# Altium project CPU-010.PrjPcb
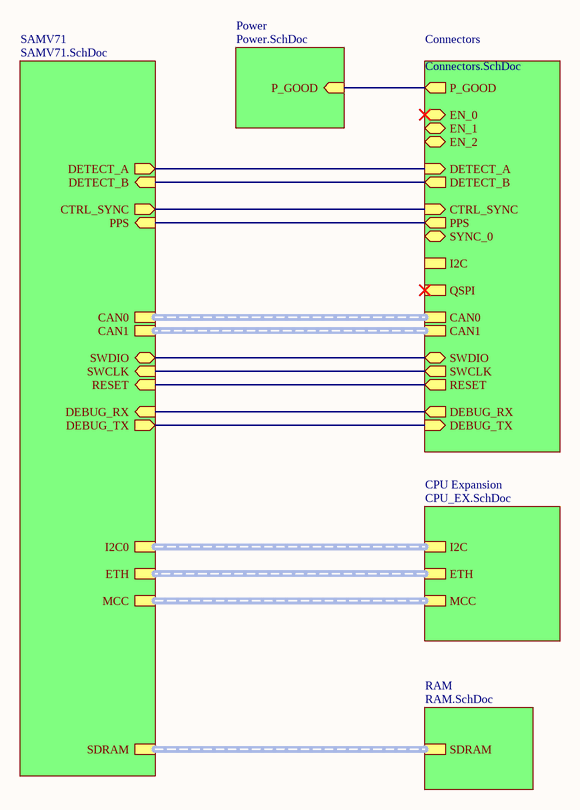
[diagram p0: Top.SchDoc]
TemplateRevision: B; ProjectTitle: SAM V71 CPU Module; ProjectRevision: A; ProjectOrganization: Let's Build Rockets Inc.; ProjectDocumentNumber: CPU-010; ProjectAuthor: E. Sims
6 sheets, 67 parts. Net scope: hierarchical (ports join the sheet entries above them; power ports are global).
Board file: CPU-010.PcbDoc
Sheets:
  Top.SchDoc
    RAM = RAM.SchDoc
    SAMV71 = SAMV71.SchDoc
    CPU Expansion = CPU_EX.SchDoc
    Connectors = Connectors.SchDoc
    Power = Power.SchDoc

## Sheet Top.SchDoc
size B; Author: E. Sims; Organization: Let's Build Rockets Inc.

### Sub-sheets
Connectors = Connectors.SchDoc: CAN0 (harness CAN), CAN1 (harness CAN), SYNC_0 (bidir), EN_2 (bidir), DETECT_A (in), SWDIO (bidir), CTRL_SYNC (in), P_GOOD (out), EN_1 (bidir), EN_0 (bidir), DETECT_B (out), DEBUG_RX (out), PPS (out), QSPI (harness QSPI), RESET (out), DEBUG_TX (in), SWCLK (out), I2C (harness I2C)
CPU Expansion = CPU_EX.SchDoc: ETH (harness ETH), MCC (harness MCC), I2C (harness I2C)
Power = Power.SchDoc: P_GOOD (in)
RAM = RAM.SchDoc: SDRAM (harness SDRAM)
SAMV71 = SAMV71.SchDoc: SDRAM (harness SDRAM), CAN0 (harness CAN), I2C0 (harness I2C), MCC (harness MCC), CAN1 (harness CAN), ETH (harness ETH), DETECT_A (out), PPS (in), DETECT_B (in), CTRL_SYNC (out), DEBUG_RX (in), SWDIO (bidir), SWCLK (in), DEBUG_TX (out), RESET (in)

### Nets
CTRL_SYNC: sheet SAMV71/CTRL_SYNC, sheet Connectors/CTRL_SYNC
DETECT_A: sheet SAMV71/DETECT_A, sheet Connectors/DETECT_A
P_GOOD: sheet Connectors/P_GOOD, sheet Power/P_GOOD
PPS: sheet SAMV71/PPS, sheet Connectors/PPS
NetP1_32: sheet SAMV71/DETECT_B, sheet Connectors/DETECT_B
NetP3_2: sheet SAMV71/SWDIO, sheet Connectors/SWDIO
NetP3_4: sheet SAMV71/SWCLK, sheet Connectors/SWCLK
NetP3_10: sheet SAMV71/RESET, sheet Connectors/RESET
NetP4_3: sheet SAMV71/DEBUG_TX, sheet Connectors/DEBUG_TX
NetP4_4: sheet SAMV71/DEBUG_RX, sheet Connectors/DEBUG_RX

### Buses and harness runs
harness sheet Connectors/CAN0 = sheet SAMV71/CAN0
harness sheet Connectors/CAN1 = sheet SAMV71/CAN1
harness sheet CPU Expansion/ETH = sheet SAMV71/ETH
harness sheet CPU Expansion/I2C = sheet SAMV71/I2C0
harness sheet CPU Expansion/MCC = sheet SAMV71/MCC
harness sheet RAM/SDRAM = sheet SAMV71/SDRAM

### Notes on the sheet
- Let's Build Rocket's Inc. Modular Paylaod System Based on TMP-010 Rev
  For more information visit https://github.com/LetsBuildRockets/Modular-Payload-System
  This work is licensed under CC BY-NC 4.0. To view a copy of this license, visit https://creativecommons.org/licenses/by-nc/4.0
- Title
- Size:
- Date:
- Assembly Variant:
- B
- Number:
- Time:
- Revision:
- Sheet
- of
- Author:
- File:

## Sheet RAM.SchDoc
size B; SheetNumber: 4; SheetTotal: 5
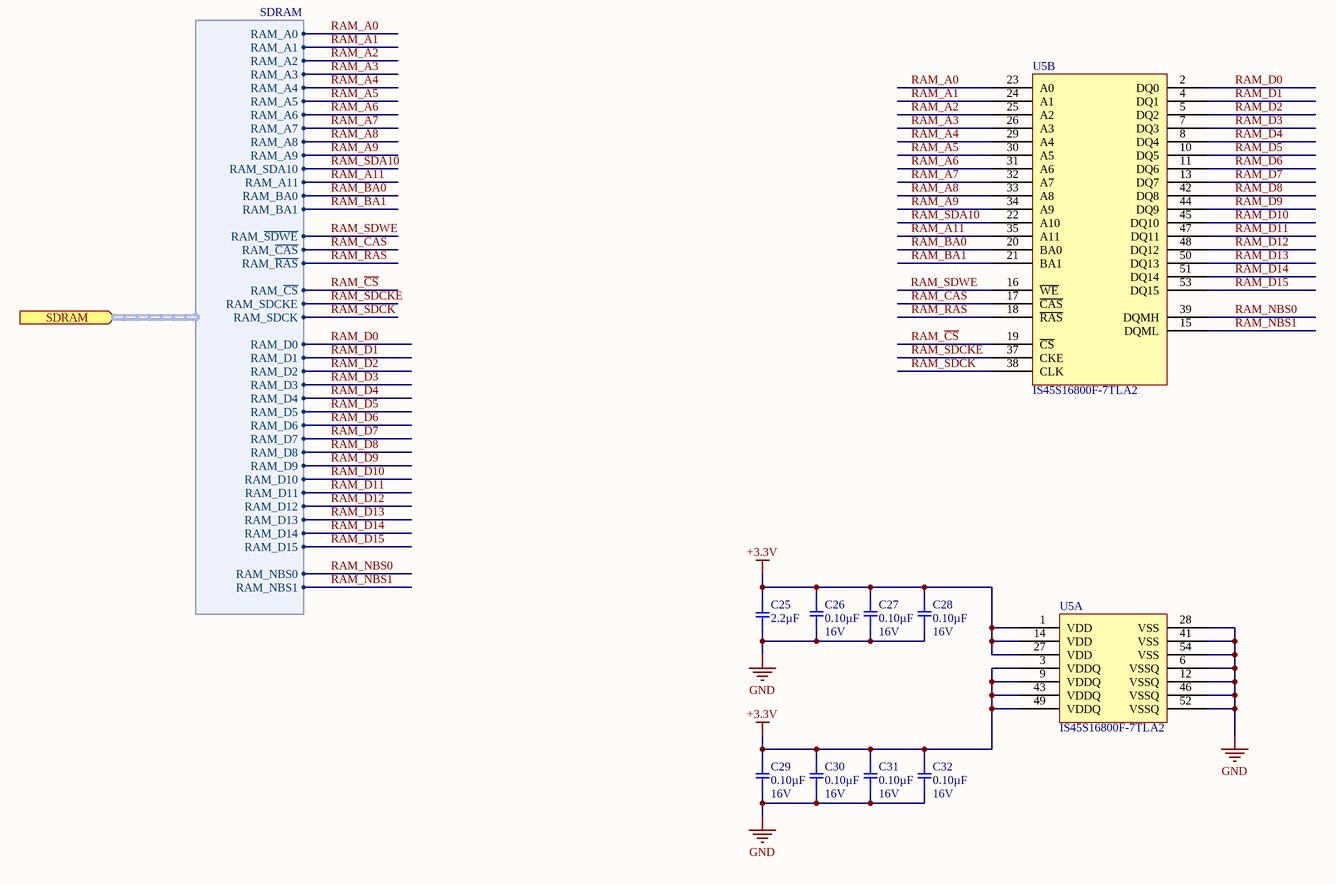
[diagram p1: RAM.SchDoc]

### Parts
C25  2.2µF  [SMD-0603C]
C26  0.10µF  Voltage: 16V  [SMD-0402C]
C27  0.10µF  Voltage: 16V  [SMD-0402C]
C28  0.10µF  Voltage: 16V  [SMD-0402C]
C29  0.10µF  Voltage: 16V  [SMD-0402C]
C30  0.10µF  Voltage: 16V  [SMD-0402C]
C31  0.10µF  Voltage: 16V  [SMD-0402C]
C32  0.10µF  Voltage: 16V  [SMD-0402C]
U5  IS45S16800F-7TLA2  [TSOP80P1180X120-54N]  (parts A,B of 2)

### Ports
SDRAM (in, harness SDRAM)

### Harnesses
SDRAM: RAM_A0, RAM_A1, RAM_A2, RAM_A3, RAM_A4, RAM_A5, RAM_A6, RAM_A7, RAM_A8, RAM_A9, RAM_SDA10, RAM_A11, RAM_BA0, RAM_BA1, RAM_~{SDWE}, RAM_~{CAS}, RAM_~{RAS}, RAM_SDCKE, RAM_SDCK, RAM_~{CS}, RAM_D0, RAM_D1, RAM_D2, RAM_D3, RAM_D4, RAM_D5, RAM_D6, RAM_D7, RAM_D8, RAM_D9, RAM_D10, RAM_D11, RAM_D12, RAM_D13, RAM_D14, RAM_D15, RAM_NBS0, RAM_NBS1

### Nets
+3.3V: C25.1 C26.2 C27.2 C28.2 C29.2 C30.2 C31.2 C32.2 U5.1(VDD) U5.3(VDDQ) U5.9(VDDQ) U5.14(VDD) U5.27(VDD) U5.43(VDDQ) U5.49(VDDQ)
GND: C25.2 C26.1 C27.1 C28.1 C29.1 C30.1 C31.1 C32.1 U5.6(VSSQ) U5.12(VSSQ) U5.28(VSS) U5.41(VSS) U5.46(VSSQ) U5.52(VSSQ) U5.54(VSS)
RAM_A0: U5.23(A0) ; port SDRAM.RAM_A0
RAM_A1: U5.24(A1) ; port SDRAM.RAM_A1
RAM_A2: U5.25(A2) ; port SDRAM.RAM_A2
RAM_A3: U5.26(A3) ; port SDRAM.RAM_A3
RAM_A4: U5.29(A4) ; port SDRAM.RAM_A4
RAM_A5: U5.30(A5) ; port SDRAM.RAM_A5
RAM_A6: U5.31(A6) ; port SDRAM.RAM_A6
RAM_A7: U5.32(A7) ; port SDRAM.RAM_A7
RAM_A8: U5.33(A8) ; port SDRAM.RAM_A8
RAM_A9: U5.34(A9) ; port SDRAM.RAM_A9
RAM_A11: U5.35(A11) ; port SDRAM.RAM_A11
RAM_BA0: U5.20(BA0) ; port SDRAM.RAM_BA0
RAM_BA1: U5.21(BA1) ; port SDRAM.RAM_BA1
RAM_~{CS}: U5.19(~{CS}) ; port SDRAM.RAM_~{CS}
RAM_CAS: U5.17(~{CAS}) ; port SDRAM.RAM_~{CAS}
RAM_D0: U5.2(DQ0) ; port SDRAM.RAM_D0
RAM_D1: U5.4(DQ1) ; port SDRAM.RAM_D1
RAM_D2: U5.5(DQ2) ; port SDRAM.RAM_D2
RAM_D3: U5.7(DQ3) ; port SDRAM.RAM_D3
RAM_D4: U5.8(DQ4) ; port SDRAM.RAM_D4
RAM_D5: U5.10(DQ5) ; port SDRAM.RAM_D5
RAM_D6: U5.11(DQ6) ; port SDRAM.RAM_D6
RAM_D7: U5.13(DQ7) ; port SDRAM.RAM_D7
RAM_D8: U5.42(DQ8) ; port SDRAM.RAM_D8
RAM_D9: U5.44(DQ9) ; port SDRAM.RAM_D9
RAM_D10: U5.45(DQ10) ; port SDRAM.RAM_D10
RAM_D11: U5.47(DQ11) ; port SDRAM.RAM_D11
RAM_D12: U5.48(DQ12) ; port SDRAM.RAM_D12
RAM_D13: U5.50(DQ13) ; port SDRAM.RAM_D13
RAM_D14: U5.51(DQ14) ; port SDRAM.RAM_D14
RAM_D15: U5.53(DQ15) ; port SDRAM.RAM_D15
RAM_NBS0: U5.39(DQMH) ; port SDRAM.RAM_NBS0
RAM_NBS1: U5.15(DQML) ; port SDRAM.RAM_NBS1
RAM_RAS: U5.18(~{RAS}) ; port SDRAM.RAM_~{RAS}
RAM_SDA10: U5.22(A10) ; port SDRAM.RAM_SDA10
RAM_SDCK: U5.38(CLK) ; port SDRAM.RAM_SDCK
RAM_SDCKE: U5.37(CKE) ; port SDRAM.RAM_SDCKE
RAM_SDWE: U5.16(~{WE}) ; port SDRAM.RAM_~{SDWE}

### Notes on the sheet
- Let's Build Rocket's Inc. Modular Paylaod System Based on TMP-010 Rev
  For more information visit https://github.com/LetsBuildRockets/Modular-Payload-System
  This work is licensed under CC BY-NC 4.0. To view a copy of this license, visit https://creativecommons.org/licenses/by-nc/4.0
- Title
- Size:
- Date:
- Assembly Variant:
- B
- Number:
- Time:
- Revision:
- Sheet
- of
- Author:
- File:

### Library data of the parts
C25 = GCM188R70J225KE22D: CAP CER 2.2UF 6.3V X7R 0603; Manufacturer: Murata Electronics North America; Factory Stock: 0; Unit Price (USD): 0.23; Minimum Quantity: 1; Tolerance: ±10%; Datasheets: http://www.murata.com/~/media/webrenewal/support/library/catalog/products/capacitor/mlcc/c03e.ashx; Image: //media.digikey.com/Renders/Murata%20Renders/0603%28GCM188%29.jpg; Digi-Key Part Number: 490-5316-1-ND; Part Number: GCM188R70J225KE22D; Quantity Available: 20695; @ qty: 0; Packaging: Cut Tape (CT); Series: GCM; Part Status: Active; Value: 2.2µF; Voltage: 6.3V; Temperature Coefficient: X7R; Operating Temperature: -55°C ~ 125°C; Features: -; Ratings: AEC-Q200; Applications: Automotive; Mounting Type: Surface Mount, MLCC; Package / Case: 0603 (1608 Metric); Size / Dimension: 0.063" L x 0.031" W (1.60mm x 0.80mm); Height - Seated (Max): -; Thickness (Max): 0.035" (0.90mm); Lead Spacing: -; Lead Style: -
C26-C32 = GCM155R71C104KA55D: CAP CER 0.1UF 16V X7R 0402; Manufacturer: Murata Electronics North America; Factory Stock: 0; Unit Price (USD): 0.1; Minimum Quantity: 1; Tolerance: ±10%; Datasheets: http://www.murata.com/~/media/webrenewal/support/library/catalog/products/capacitor/mlcc/c03e.ashx; Image: //media.digikey.com/Renders/Murata%20Renders/ZRB-SERIES-0402.jpg; Digi-Key Part Number: 490-4759-1-ND; Part Number: GCM155R71C104KA55D; Quantity Available: 734194; @ qty: 0; Packaging: Cut Tape (CT); Series: GCM; Part Status: Active; Value: 0.10µF; Temperature Coefficient: X7R; Operating Temperature: -55°C ~ 125°C; Features: -; Ratings: AEC-Q200; Applications: Automotive; Mounting Type: Surface Mount, MLCC; Package / Case: 0402 (1005 Metric); Size / Dimension: 0.039" L x 0.020" W (1.00mm x 0.50mm); Height - Seated (Max): -; Thickness (Max): 0.022" (0.55mm); Lead Spacing: -; Lead Style: -
U5 = IS45S16800F-7TLA2: Unit Price (USD): 5.18

## Sheet SAMV71.SchDoc: =ProjectTitle
size B; Author: E. Sims; Organization: Let's Build Rockets Inc.; Revision: A; SheetNumber: 3; SheetTotal: 5
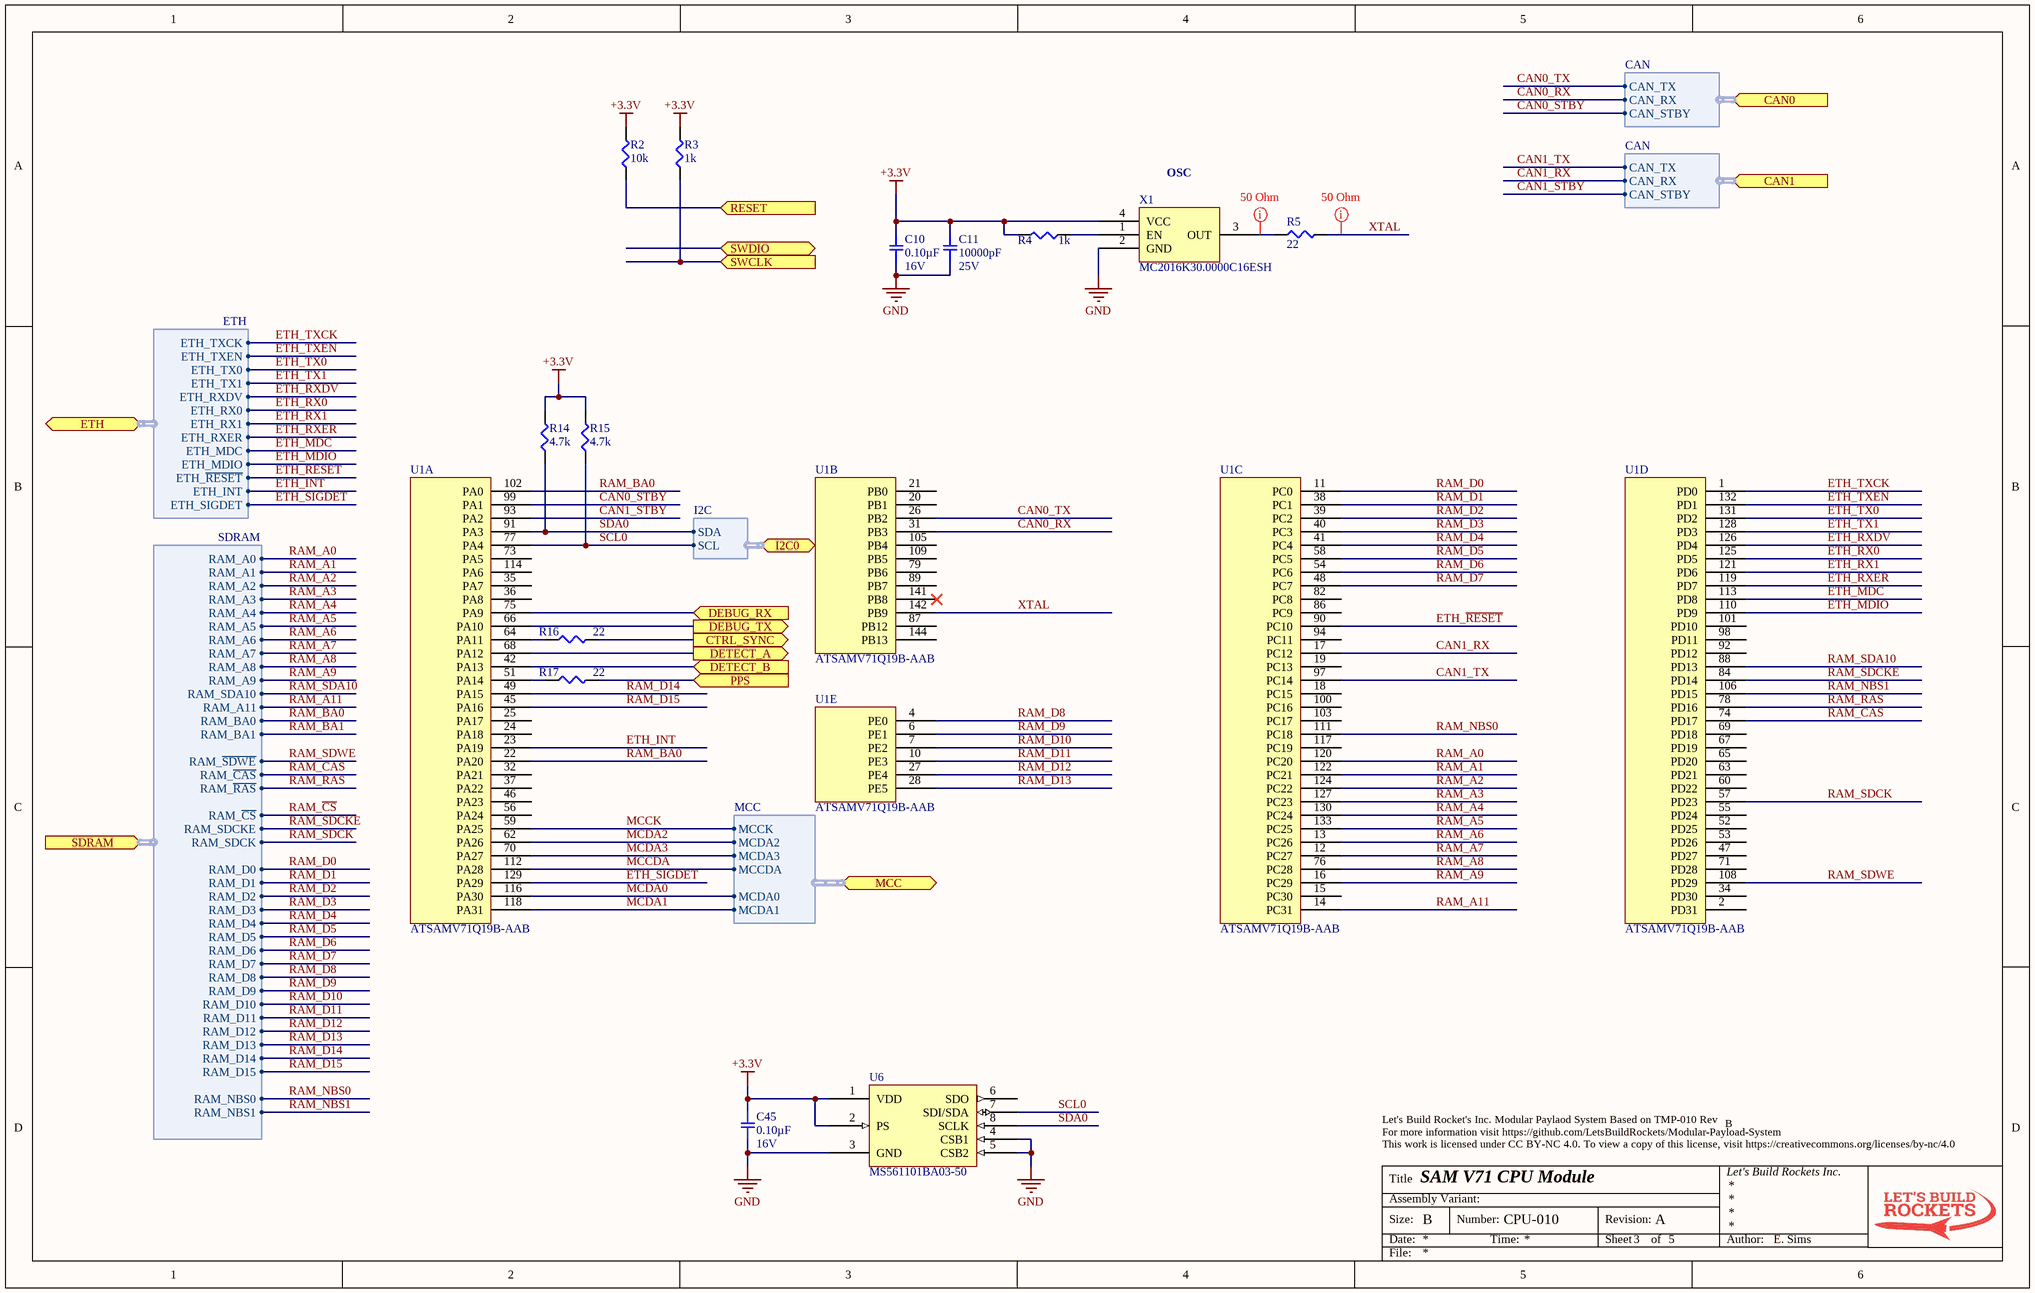
[diagram p2: SAMV71.SchDoc]

### Parts
C10  0.10µF  Voltage: 16V  [SMD-0402C]
C11  10000pF  Voltage: 25V  [SMD-0402C]
C45  0.10µF  Voltage: 16V  [SMD-0402C]
R2  10k  [SMD-0402-RES]
R3  1k  [SMD-0402-RES]
R4  1k  [SMD-0402-RES]
R5  22  [SMD-0402-RES]
R14  4.7k  [SMD-0402-RES]
R15  4.7k  [SMD-0402-RES]
R16  22  [SMD-0402-RES]
R17  22  [SMD-0402-RES]
U1  ATSAMV71Q19B-AAB  [TSQFP50P2200X2200X160-144N]  (parts A,B,C,D,E of 6)
U6  MS561101BA03-50  [MS561101BA03-50]
X1  MC2016K30.0000C16ESH  [MC2016]

### Ports
CAN0 (in, harness CAN), CAN1 (in, harness CAN), CTRL_SYNC (out), DEBUG_RX (in), DEBUG_TX (out), DETECT_A (out), DETECT_B (in), ETH (bidir, harness ETH), I2C0 (bidir, harness I2C), MCC (bidir, harness MCC), PPS (in), RESET (in), SDRAM (in, harness SDRAM), SWCLK (in), SWDIO (bidir)

### Harnesses
SDRAM: RAM_A0, RAM_A1, RAM_A2, RAM_A3, RAM_A4, RAM_A5, RAM_A6, RAM_A7, RAM_A8, RAM_A9, RAM_SDA10, RAM_A11, RAM_BA0, RAM_BA1, RAM_~{SDWE}, RAM_~{CAS}, RAM_~{RAS}, RAM_SDCKE, RAM_SDCK, RAM_~{CS}, RAM_D0, RAM_D1, RAM_D2, RAM_D3, RAM_D4, RAM_D5, RAM_D6, RAM_D7, RAM_D8, RAM_D9, RAM_D10, RAM_D11, RAM_D12, RAM_D13, RAM_D14, RAM_D15, RAM_NBS0, RAM_NBS1
CAN: CAN_TX, CAN_RX, CAN_STBY
MCC: MCCK, MCCDA, MCDA0, MCDA1, MCDA2, MCDA3
ETH: ETH_TXCK, ETH_TXEN, ETH_TX0, ETH_TX1, ETH_RXDV, ETH_RX0, ETH_RX1, ETH_RXER, ETH_MDC, ETH_MDIO, ETH_~{RESET}, ETH_INT, ETH_SIGDET
I2C: SDA, SCL

### Nets
+3.3V: C10.2 C11.2 C45.2 R2.2 R3.2 R4.2 R14.2 R15.2 U6.1(VDD) U6.2(PS) X1.4(VCC)
GND: C10.1 C11.1 C45.1 U6.3(GND) U6.4(CSB1) U6.5(CSB2) X1.2(GND)
CAN0_RX: U1.31(PB3) ; port CAN0.CAN_RX
CAN0_STBY: U1.99(PA1) ; port CAN0.CAN_STBY
CAN0_TX: U1.26(PB2) ; port CAN0.CAN_TX
CAN1_RX: U1.17(PC12) ; port CAN1.CAN_RX
CAN1_STBY: U1.93(PA2) ; port CAN1.CAN_STBY
CAN1_TX: U1.97(PC14) ; port CAN1.CAN_TX
CTRL_SYNC: R16.2 ; port CTRL_SYNC
DETECT_A: U1.68(PA12) ; port DETECT_A
ETH_INT: U1.23(PA19) ; port ETH.ETH_INT
ETH_MDC: U1.113(PD8) ; port ETH.ETH_MDC
ETH_MDIO: U1.110(PD9) ; port ETH.ETH_MDIO
ETH_~{RESET}: U1.90(PC10) ; port ETH.ETH_~{RESET}
ETH_RX0: U1.125(PD5) ; port ETH.ETH_RX0
ETH_RX1: U1.121(PD6) ; port ETH.ETH_RX1
ETH_RXDV: U1.126(PD4) ; port ETH.ETH_RXDV
ETH_RXER: U1.119(PD7) ; port ETH.ETH_RXER
ETH_SIGDET: U1.129(PA29) ; port ETH.ETH_SIGDET
ETH_TX0: U1.131(PD2) ; port ETH.ETH_TX0
ETH_TX1: U1.128(PD3) ; port ETH.ETH_TX1
ETH_TXCK: U1.1(PD0) ; port ETH.ETH_TXCK
ETH_TXEN: U1.132(PD1) ; port ETH.ETH_TXEN
MCCDA: U1.112(PA28) ; port MCC.MCCDA
MCCK: U1.59(PA25) ; port MCC.MCCK
MCDA0: U1.116(PA30) ; port MCC.MCDA0
MCDA1: U1.118(PA31) ; port MCC.MCDA1
MCDA2: U1.62(PA26) ; port MCC.MCDA2
MCDA3: U1.70(PA27) ; port MCC.MCDA3
PPS: R17.2 ; port PPS
RAM_A0: U1.120(PC20) ; port SDRAM.RAM_A0
RAM_A1: U1.122(PC21) ; port SDRAM.RAM_A1
RAM_A2: U1.124(PC22) ; port SDRAM.RAM_A2
RAM_A3: U1.127(PC23) ; port SDRAM.RAM_A3
RAM_A4: U1.130(PC24) ; port SDRAM.RAM_A4
RAM_A5: U1.133(PC25) ; port SDRAM.RAM_A5
RAM_A6: U1.13(PC26) ; port SDRAM.RAM_A6
RAM_A7: U1.12(PC27) ; port SDRAM.RAM_A7
RAM_A8: U1.76(PC28) ; port SDRAM.RAM_A8
RAM_A9: U1.16(PC29) ; port SDRAM.RAM_A9
RAM_A11: U1.14(PC31) ; port SDRAM.RAM_A11
RAM_BA0: U1.22(PA20) U1.102(PA0) ; port SDRAM.RAM_BA0
RAM_CAS: U1.74(PD17) ; port SDRAM.RAM_~{CAS}
RAM_D0: U1.11(PC0) ; port SDRAM.RAM_D0
RAM_D1: U1.38(PC1) ; port SDRAM.RAM_D1
RAM_D2: U1.39(PC2) ; port SDRAM.RAM_D2
RAM_D3: U1.40(PC3) ; port SDRAM.RAM_D3
RAM_D4: U1.41(PC4) ; port SDRAM.RAM_D4
RAM_D5: U1.58(PC5) ; port SDRAM.RAM_D5
RAM_D6: U1.54(PC6) ; port SDRAM.RAM_D6
RAM_D7: U1.48(PC7) ; port SDRAM.RAM_D7
RAM_D8: U1.4(PE0) ; port SDRAM.RAM_D8
RAM_D9: U1.6(PE1) ; port SDRAM.RAM_D9
RAM_D10: U1.7(PE2) ; port SDRAM.RAM_D10
RAM_D11: U1.10(PE3) ; port SDRAM.RAM_D11
RAM_D12: U1.27(PE4) ; port SDRAM.RAM_D12
RAM_D13: U1.28(PE5) ; port SDRAM.RAM_D13
RAM_D14: U1.49(PA15) ; port SDRAM.RAM_D14
RAM_D15: U1.45(PA16) ; port SDRAM.RAM_D15
RAM_NBS0: U1.111(PC18) ; port SDRAM.RAM_NBS0
RAM_NBS1: U1.106(PD15) ; port SDRAM.RAM_NBS1
RAM_RAS: U1.78(PD16) ; port SDRAM.RAM_~{RAS}
RAM_SDA10: U1.88(PD13) ; port SDRAM.RAM_SDA10
RAM_SDCK: U1.57(PD23) ; port SDRAM.RAM_SDCK
RAM_SDCKE: U1.84(PD14) ; port SDRAM.RAM_SDCKE
RAM_SDWE: U1.108(PD29) ; port SDRAM.RAM_~{SDWE}
SCL0: R15.1 U1.77(PA4) U6.7(SDI/SDA) ; port I2C0.SCL
SDA0: R14.1 U1.91(PA3) U6.8(SCLK) ; port I2C0.SDA
XTAL: R5.2 U1.142(PB9)
NetP1_32: U1.42(PA13) ; port DETECT_B
NetP3_4: R3.1 ; port SWCLK
NetP3_10: R2.1 ; port RESET
NetP4_3: U1.66(PA10) ; port DEBUG_TX
NetP4_4: U1.75(PA9) ; port DEBUG_RX
NetR4_1: R4.1 X1.1(EN)
NetR5_1: R5.1 X1.3(OUT)
NetR16_1: R16.1 U1.64(PA11)
NetR17_1: R17.1 U1.51(PA14)

Not connected (* = marked no-connect by the designer): U1 2(PD31) 15(PC30) 18(PC15) 19(PC13) 20(PB1) 21(PB0) 24(PA18) 25(PA17) 32(PA21) 34(PD30) 35(PA7) 36(PA8) 37(PA22) 46(PA23) 47(PD27) 52(PD25) 53(PD26) 55(PD24) 56(PA24) 60(PD22) 63(PD21) 65(PD20) 67(PD19) 69(PD18) 71(PD28) 73(PA5) 79(PB6) 82(PC8) 86(PC9) 87(PB12) 89(PB7) 92(PD12) 94(PC11) 98(PD11) 100(PC16) 101(PD10) 103(PC17) 105(PB4) 109(PB5) 114(PA6) 117(PC19) 141(PB8)* 144(PB13); U6 6(SDO)

### Layout directives
rule Width Constraint [Pref Impedance = 50.00ohms    Min Impedance = 50.00ohms    Max Impedance = 50.00ohms]: NetR5_1, XTAL

### Notes on the sheet
- (near X1) OSC
- Let's Build Rocket's Inc. Modular Paylaod System Based on TMP-010 Rev
  For more information visit https://github.com/LetsBuildRockets/Modular-Payload-System
  This work is licensed under CC BY-NC 4.0. To view a copy of this license, visit https://creativecommons.org/licenses/by-nc/4.0
- Title
- Size:
- Date:
- Assembly Variant:
- B
- Number:
- Time:
- Revision:
- Sheet
- of
- Author:
- File:

### Library data of the parts
C10 C45 = GCM155R71C104KA55D: as C26 on sheet RAM; Datasheets: http://www.murata.com/~/media/webrenewal/support/library/catalog/products/capacitor/mlcc/c03e.ashx; Image: //media.digikey.com/Renders/Murata%20Renders/ZRB-SERIES-0402.jpg; Digi-Key Part Number: 490-4759-1-ND; Part Number: GCM155R71C104KA55D; Quantity Available: 734194; @ qty: 0; Packaging: Cut Tape (CT); Series: GCM; Part Status: Active; Value: 0.10µF; Temperature Coefficient: X7R; Operating Temperature: -55°C ~ 125°C; Features: -; Ratings: AEC-Q200; Applications: Automotive; Mounting Type: Surface Mount, MLCC; Package / Case: 0402 (1005 Metric); Size / Dimension: 0.039" L x 0.020" W (1.00mm x 0.50mm); Height - Seated (Max): -; Thickness (Max): 0.022" (0.55mm); Lead Spacing: -; Lead Style: -
C11 = GCM155R71E103KA37D: CAP CER 10000PF 25V X7R 0402; Manufacturer: Murata Electronics North America; Factory Stock: 0; Unit Price (USD): 0.1; Minimum Quantity: 1; Tolerance: ±10%; Datasheets: http://www.murata.com/~/media/webrenewal/support/library/catalog/products/capacitor/mlcc/c03e.ashx; Image: //media.digikey.com/Renders/Murata%20Renders/ZRB-SERIES-0402.jpg; Digi-Key Part Number: 490-6043-1-ND; Part Number: GCM155R71E103KA37D; Quantity Available: 128782; @ qty: 0; Packaging: Cut Tape (CT); Series: GCM; Part Status: Active; Value: 10000pF; Temperature Coefficient: X7R; Operating Temperature: -55°C ~ 125°C; Features: -; Ratings: AEC-Q200; Applications: Automotive; Mounting Type: Surface Mount, MLCC; Package / Case: 0402 (1005 Metric); Size / Dimension: 0.039" L x 0.020" W (1.00mm x 0.50mm); Height - Seated (Max): -; Thickness (Max): 0.022" (0.55mm); Lead Spacing: -; Lead Style: -
R2 = ERJ-2GEJ103X: RES SMD 10K OHM 5% 1/10W 0402; Manufacturer: Panasonic Electronic Components; Factory Stock: 0; Unit Price (USD): 0.00350; @ qty: 1500; Minimum Quantity: 1; Power (Watts): 0.1W, 1/10W; Temperature Coefficient: ±200ppm/°C; Part Number: ERJ-2GEJ103X; Datasheets: http://industrial.panasonic.com/www-cgi/jvcr13pz.cgi?E+PZ+3+AOA0001+ERJ2GEJ103X+7+WW; Image: //media.digikey.com/Photos/Panasonic%20Photos/ERJ-PA2-Series.jpg; Digi-Key Part Number: P10KJCT-ND; Quantity Available: 2560215; Packaging: Cut Tape (CT); Series: ERJ; Part Status: Active; Value: 10k; Tolerance: ±5%; Composition: Thick Film; Features: Automotive AEC-Q200; Operating Temperature: -55°C ~ 155°C; Package / Case: 0402 (1005 Metric); Supplier Device Package: 0402; Size / Dimension: 0.039" L x 0.020" W (1.00mm x 0.50mm); Height - Seated (Max): 0.016" (0.40mm); Number of Terminations: 2; Failure Rate: -
R3 R4 = ERJ-2GEJ102X: RES SMD 1K OHM 5% 1/10W 0402; Manufacturer: Panasonic Electronic Components; Factory Stock: 0; Unit Price (USD): 0.00350; @ qty: 1500; Minimum Quantity: 1; Power (Watts): 0.1W, 1/10W; Temperature Coefficient: ±200ppm/°C; Part Number: ERJ-2GEJ102X; Datasheets: http://industrial.panasonic.com/www-cgi/jvcr13pz.cgi?E+PZ+3+AOA0001+ERJ2GEJ102X+7+WW; Image: //media.digikey.com/Photos/Panasonic%20Photos/ERJ-PA2-Series.jpg; Digi-Key Part Number: P1.0KJCT-ND; Quantity Available: 1939857; Packaging: Cut Tape (CT); Series: ERJ; Part Status: Active; Value: 1k; Tolerance: ±5%; Composition: Thick Film; Features: Automotive AEC-Q200; Operating Temperature: -55°C ~ 155°C; Package / Case: 0402 (1005 Metric); Supplier Device Package: 0402; Size / Dimension: 0.039" L x 0.020" W (1.00mm x 0.50mm); Height - Seated (Max): 0.016" (0.40mm); Number of Terminations: 2; Failure Rate: -
R5 R16 R17 = ERJ-2RKF22R0X: RES SMD 22 OHM 1% 1/10W 0402; Manufacturer: Panasonic Electronic Components; Factory Stock: 0; Unit Price (USD): 0.00496; @ qty: 1500; Minimum Quantity: 1; Power (Watts): 0.1W, 1/10W; Temperature Coefficient: ±100ppm/°C; Part Number: ERJ-2RKF22R0X; Datasheets: http://industrial.panasonic.com/www-cgi/jvcr13pz.cgi?E+PZ+3+AOA0002+ERJ2RKF22R0X+7+WW; Image: //media.digikey.com/Photos/Panasonic%20Photos/ERJ-PA2-Series.jpg; Digi-Key Part Number: P22.0LCT-ND; Quantity Available: 620432; Packaging: Cut Tape (CT); Series: ERJ; Part Status: Active; Value: 22; Tolerance: ±1%; Composition: Thick Film; Features: Automotive AEC-Q200; Operating Temperature: -55°C ~ 155°C; Package / Case: 0402 (1005 Metric); Supplier Device Package: 0402; Size / Dimension: 0.039" L x 0.020" W (1.00mm x 0.50mm); Height - Seated (Max): 0.016" (0.40mm); Number of Terminations: 2; Failure Rate: -
R14 R15 = ERJ-2GEJ472X: RES SMD 4.7K OHM 5% 1/10W 0402; Manufacturer: Panasonic Electronic Components; Factory Stock: 0; Unit Price (USD): 0.00350; @ qty: 1500; Minimum Quantity: 1; Power (Watts): 0.1W, 1/10W; Temperature Coefficient: ±200ppm/°C; Part Number: ERJ-2GEJ472X; Datasheets: http://industrial.panasonic.com/www-cgi/jvcr13pz.cgi?E+PZ+3+AOA0001+ERJ2GEJ472X+7+WW; Image: //media.digikey.com/Photos/Panasonic%20Photos/ERJ-PA2-Series.jpg; Digi-Key Part Number: P4.7KJCT-ND; Quantity Available: 8551774; Packaging: Cut Tape (CT); Series: ERJ; Part Status: Active; Value: 4.7k; Tolerance: ±5%; Composition: Thick Film; Features: Automotive AEC-Q200; Operating Temperature: -55°C ~ 155°C; Package / Case: 0402 (1005 Metric); Supplier Device Package: 0402; Size / Dimension: 0.039" L x 0.020" W (1.00mm x 0.50mm); Height - Seated (Max): 0.016" (0.40mm); Number of Terminations: 2; Failure Rate: -
U1 = ATSAMV71Q19B-AAB: Unit Price (USD): 10.74
U6 = MS561101BA03-50: Unit Price (USD): 12.22
X1 = MC2016K30.0000C16ESH: Unit Price (USD): 2.37

## Sheet CPU_EX.SchDoc
size B; Author: E. Sims; Organization: Let's Build Rockets Inc.
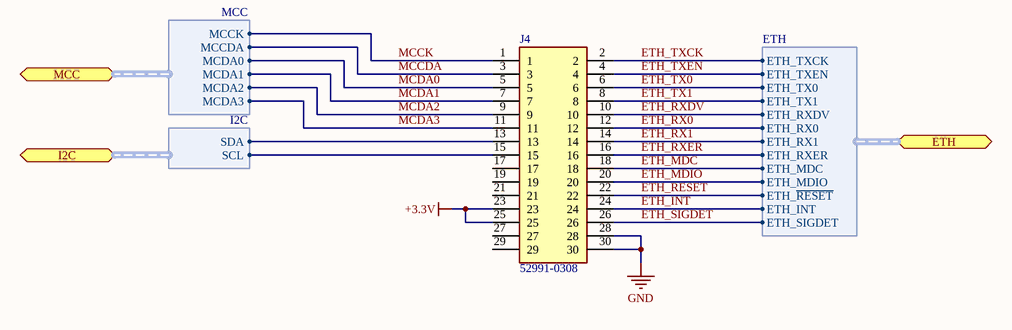
[diagram p3: CPU_EX.SchDoc]

### Parts
J4  52991-0308  [529910308]

### Ports
ETH (bidir, harness ETH), I2C (bidir, harness I2C), MCC (bidir, harness MCC)

### Harnesses
MCC: MCCK, MCCDA, MCDA0, MCDA1, MCDA2, MCDA3
ETH: ETH_TXCK, ETH_TXEN, ETH_TX0, ETH_TX1, ETH_RXDV, ETH_RX0, ETH_RX1, ETH_RXER, ETH_MDC, ETH_MDIO, ETH_~{RESET}, ETH_INT, ETH_SIGDET
I2C: SDA, SCL

### Nets
+3.3V: J4.23 J4.25
GND: J4.28 J4.30
ETH_INT: J4.24 ; port ETH.ETH_INT
ETH_MDC: J4.18 ; port ETH.ETH_MDC
ETH_MDIO: J4.20 ; port ETH.ETH_MDIO
ETH_~{RESET}: J4.22 ; port ETH.ETH_~{RESET}
ETH_RX0: J4.12 ; port ETH.ETH_RX0
ETH_RX1: J4.14 ; port ETH.ETH_RX1
ETH_RXDV: J4.10 ; port ETH.ETH_RXDV
ETH_RXER: J4.16 ; port ETH.ETH_RXER
ETH_SIGDET: J4.26 ; port ETH.ETH_SIGDET
ETH_TX0: J4.6 ; port ETH.ETH_TX0
ETH_TX1: J4.8 ; port ETH.ETH_TX1
ETH_TXCK: J4.2 ; port ETH.ETH_TXCK
ETH_TXEN: J4.4 ; port ETH.ETH_TXEN
MCCDA: J4.3 ; port MCC.MCCDA
MCCK: J4.1 ; port MCC.MCCK
MCDA0: J4.5 ; port MCC.MCDA0
MCDA1: J4.7 ; port MCC.MCDA1
MCDA2: J4.9 ; port MCC.MCDA2
MCDA3: J4.11 ; port MCC.MCDA3
SCL0: J4.15 ; port I2C.SCL
SDA0: J4.13 ; port I2C.SDA

Not connected (* = marked no-connect by the designer): J4 17 19 21 27 29

### Notes on the sheet
- Let's Build Rocket's Inc. Modular Paylaod System Based on TMP-010 Rev
  For more information visit https://github.com/LetsBuildRockets/Modular-Payload-System
  This work is licensed under CC BY-NC 4.0. To view a copy of this license, visit https://creativecommons.org/licenses/by-nc/4.0
- Title
- Size:
- Date:
- Assembly Variant:
- B
- Number:
- Time:
- Revision:
- Sheet
- of
- Author:
- File:

### Library data of the parts
J4 = 52991-0308: Connector; Manufacturer_Name: Molex; Unit Price (USD): 1.43; Datasheet Link: https://www.molex.com/pdm_docs/sd/529910308_sd.pdf; Height: 2.47mm; Manufacturer_Part_Number: 52991-0308; System: Connector

## Sheet Connectors.SchDoc: =ProjectTitle
size B; Author: E. Sims; Organization: Let's Build Rockets Inc.; Revision: A; SheetNumber: 1; SheetTotal: 5
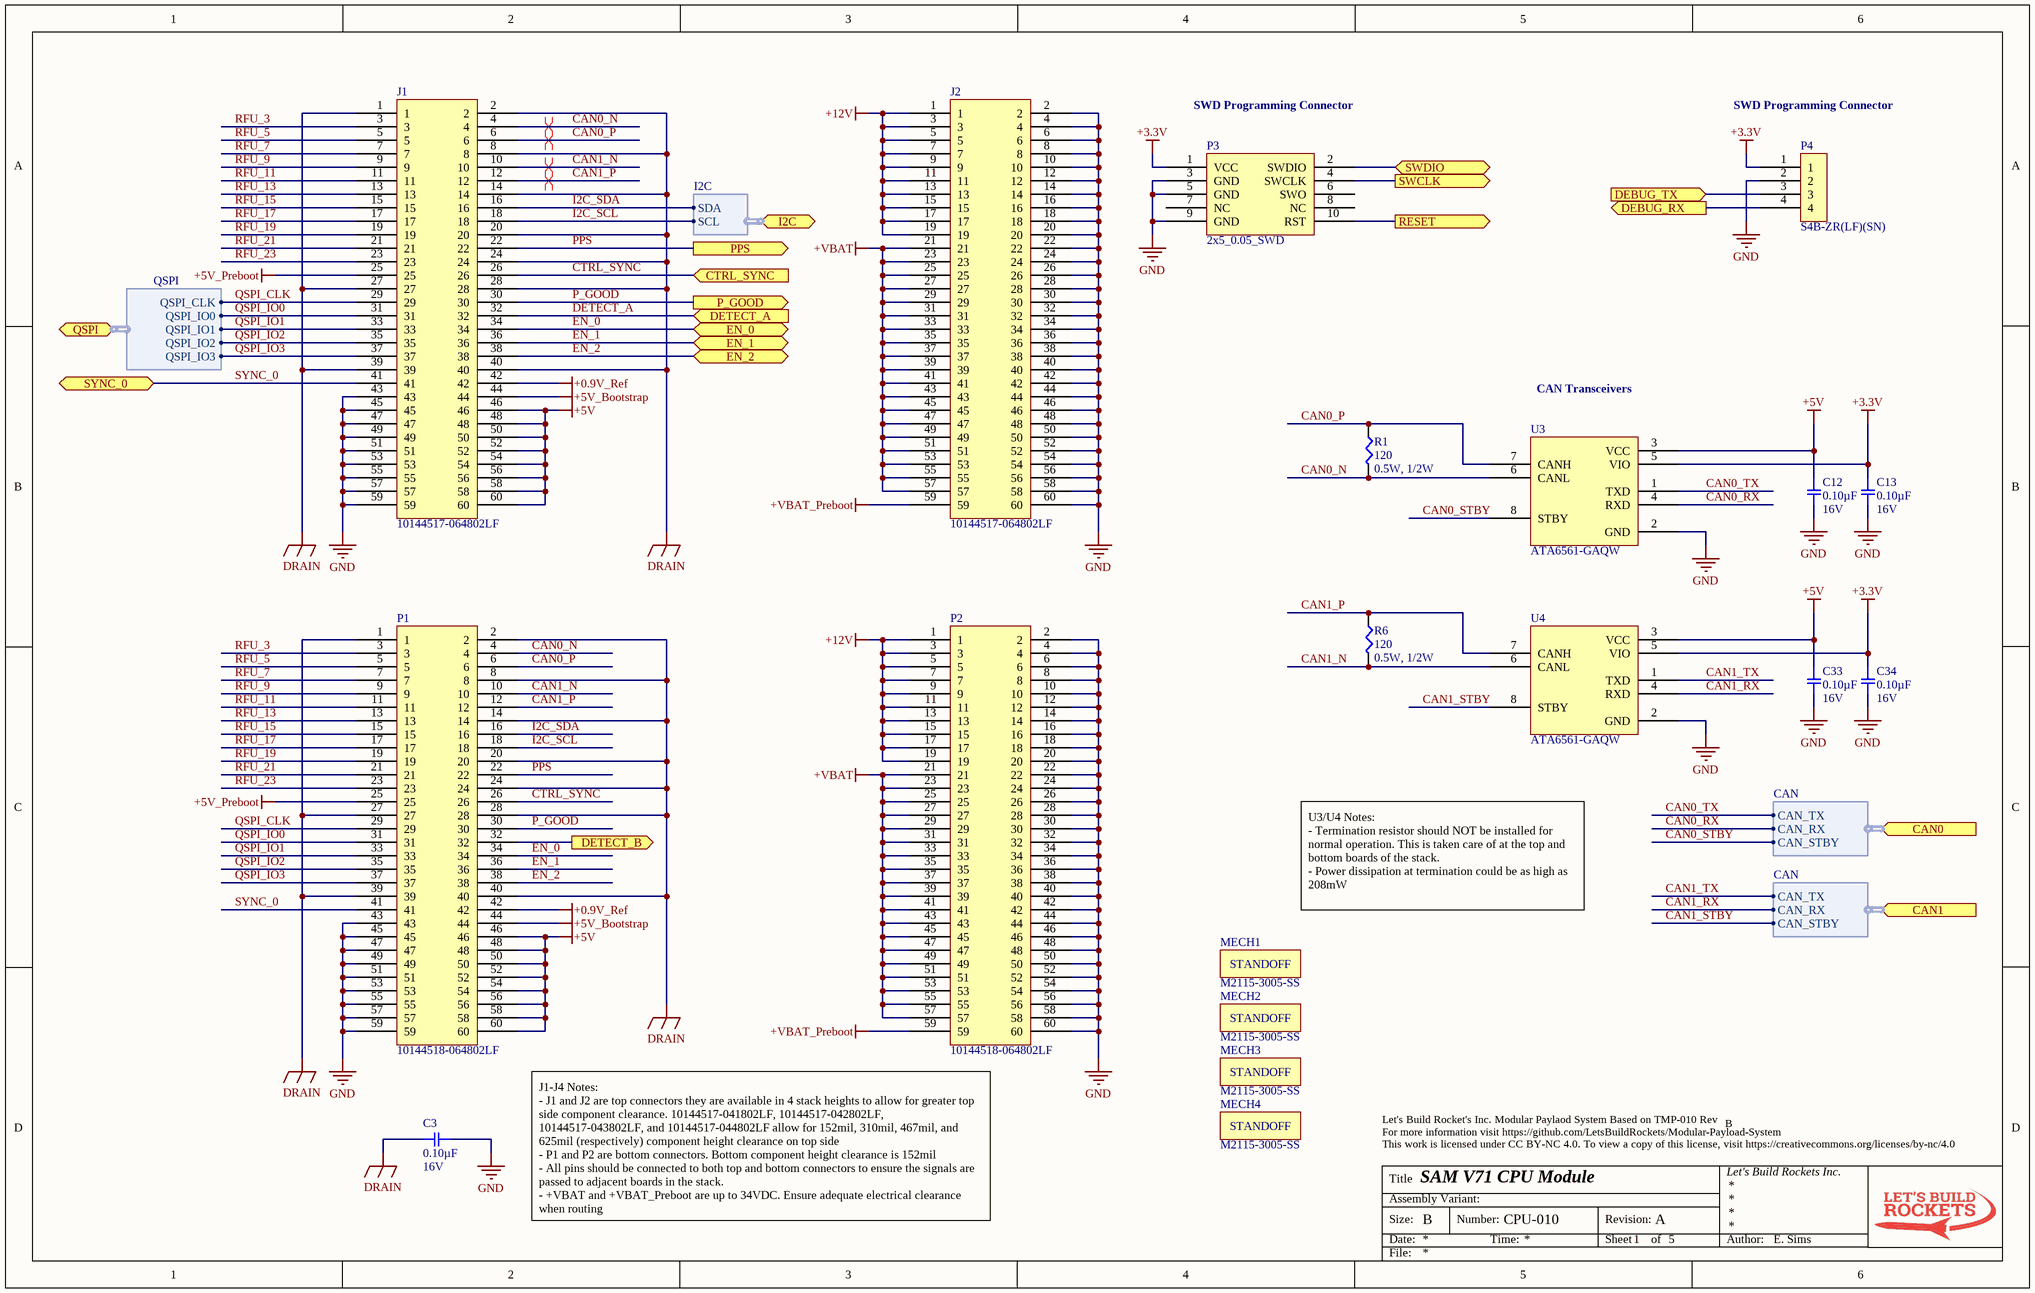
[diagram p4: Connectors.SchDoc]

### Parts
C3  0.10µF  Voltage: 16V  [SMD-0402C]
C12  0.10µF  Voltage: 16V  [SMD-0402C]
C13  0.10µF  Voltage: 16V  [SMD-0402C]
C33  0.10µF  Voltage: 16V  [SMD-0402C]
C34  0.10µF  Voltage: 16V  [SMD-0402C]
J1  10144517-064802LF  [10144517-064802LF]
J2  10144517-064802LF  [10144517-064802LF]
MECH1  M2115-3005-SS  [M2115-3005-SS]
MECH2  M2115-3005-SS  [M2115-3005-SS]
MECH3  M2115-3005-SS  [M2115-3005-SS]
MECH4  M2115-3005-SS  [M2115-3005-SS]
P1  10144518-064802LF  [10144518-064802LF]
P2  10144518-064802LF  [10144518-064802LF]
P3  2x5_0.05_SWD  [2x5_0.05_R]
P4  S4B-ZR(LF)(SN)  [S4B-ZR(LF)(SN)]
R1  120  Power (Watts): 0.5W, 1/2W  [SMD-0805-RES]
R6  120  Power (Watts): 0.5W, 1/2W  [SMD-0805-RES]
U3  ATA6561-GAQW  [SOIC127P600X175-8N]
U4  ATA6561-GAQW  [SOIC127P600X175-8N]

### Ports
CAN0 (in, harness CAN), CAN1 (in, harness CAN), CTRL_SYNC (in), DEBUG_RX (out), DEBUG_TX (in), DETECT_A (in), DETECT_B (out), EN_0 (bidir), EN_1 (bidir), EN_2 (bidir), I2C (bidir, harness I2C), P_GOOD (out), PPS (out), QSPI (bidir, harness QSPI), RESET (out), SWCLK (out), SWDIO (bidir), SYNC_0 (bidir)

### Harnesses
CAN: CAN_TX, CAN_RX, CAN_STBY
QSPI: QSPI_CLK, QSPI_IO0, QSPI_IO1, QSPI_IO2, QSPI_IO3
I2C: SDA, SCL

### Nets
+0.9V_Ref: J1.42 P1.42
+3.3V: C13.1 C34.1 P3.1(VCC) P4.1 U3.5(VIO) U4.5(VIO)
+5V: C12.1 C33.1 J1.46 J1.48 J1.50 J1.52 J1.54 J1.56 J1.58 J1.60 P1.46 P1.48 P1.50 P1.52 P1.54 P1.56 P1.58 P1.60 U3.3(VCC) U4.3(VCC)
+5V_Bootstrap: J1.44 P1.44
+5V_Preboot: J1.25 P1.25
+12V: J2.1 J2.3 J2.5 J2.7 J2.9 J2.11 J2.13 J2.15 J2.17 J2.19 P2.1 P2.3 P2.5 P2.7 P2.9 P2.11 P2.13 P2.15 P2.17 P2.19
+VBAT: J2.21 J2.23 J2.25 J2.27 J2.29 J2.31 J2.33 J2.35 J2.37 J2.39 J2.41 J2.43 J2.45 J2.47 J2.49 J2.51 J2.53 J2.55 J2.57 P2.21 P2.23 P2.25 P2.27 P2.29 P2.31 P2.33 P2.35 P2.37 P2.39 P2.41 P2.43 P2.45 P2.47 P2.49 P2.51 P2.53 P2.55 P2.57
+VBAT_Preboot: J2.59 P2.59
DRAIN: C3.2 J1.1 J1.2 J1.8 J1.14 J1.20 J1.24 J1.27 J1.28 J1.39 J1.40 P1.1 P1.2 P1.8 P1.14 P1.20 P1.24 P1.27 P1.28 P1.39 P1.40
GND: C3.1 C12.2 C13.2 C33.2 C34.2 J1.43 J1.45 J1.47 J1.49 J1.51 J1.53 J1.55 J1.57 J1.59 J2.2 J2.4 J2.6 J2.8 J2.10 J2.12 J2.14 J2.16 J2.18 J2.20 J2.22 J2.24 J2.26 J2.28 J2.30 J2.32 J2.34 J2.36 J2.38 J2.40 J2.42 J2.44 J2.46 J2.48 J2.50 J2.52 J2.54 J2.56 J2.58 J2.60 P1.43 P1.45 P1.47 P1.49 P1.51 P1.53 P1.55 P1.57 P1.59 P2.2 P2.4 P2.6 P2.8 P2.10 P2.12 P2.14 P2.16 P2.18 P2.20 P2.22 P2.24 P2.26 P2.28 P2.30 P2.32 P2.34 P2.36 P2.38 P2.40 P2.42 P2.44 P2.46 P2.48 P2.50 P2.52 P2.54 P2.56 P2.58 P2.60 P3.3(GND) P3.5(GND) P3.9(GND) P4.2 U3.2(GND) U4.2(GND)
CAN0_N: J1.4 P1.4 R1.2 U3.6(CANL)
CAN0_P: J1.6 P1.6 R1.1 U3.7(CANH)
CAN0_RX: U3.4(RXD) ; port CAN0.CAN_RX
CAN0_STBY: U3.8(STBY) ; port CAN0.CAN_STBY
CAN0_TX: U3.1(TXD) ; port CAN0.CAN_TX
CAN1_N: J1.10 P1.10 R6.2 U4.6(CANL)
CAN1_P: J1.12 P1.12 R6.1 U4.7(CANH)
CAN1_RX: U4.4(RXD) ; port CAN1.CAN_RX
CAN1_STBY: U4.8(STBY) ; port CAN1.CAN_STBY
CAN1_TX: U4.1(TXD) ; port CAN1.CAN_TX
CTRL_SYNC: J1.26 P1.26 ; port CTRL_SYNC
DETECT_A: J1.32 ; port DETECT_A
EN_0: J1.34 P1.34 ; port EN_0
EN_1: J1.36 P1.36 ; port EN_1
EN_2: J1.38 P1.38 ; port EN_2
I2C_SCL: J1.18 P1.18 ; port I2C.SCL
I2C_SDA: J1.16 P1.16 ; port I2C.SDA
P_GOOD: J1.30 P1.30 ; port P_GOOD
PPS: J1.22 P1.22 ; port PPS
QSPI_CLK: J1.29 P1.29 ; port QSPI.QSPI_CLK
QSPI_IO0: J1.31 P1.31 ; port QSPI.QSPI_IO0
QSPI_IO1: J1.33 P1.33 ; port QSPI.QSPI_IO1
QSPI_IO2: J1.35 P1.35 ; port QSPI.QSPI_IO2
QSPI_IO3: J1.37 P1.37 ; port QSPI.QSPI_IO3
RFU_3: J1.3 P1.3
RFU_5: J1.5 P1.5
RFU_7: J1.7 P1.7
RFU_9: J1.9 P1.9
RFU_11: J1.11 P1.11
RFU_13: J1.13 P1.13
RFU_15: J1.15 P1.15
RFU_17: J1.17 P1.17
RFU_19: J1.19 P1.19
RFU_21: J1.21 P1.21
RFU_23: J1.23 P1.23
SYNC_0: J1.41 P1.41 ; port SYNC_0
NetP1_32: P1.32 ; port DETECT_B
NetP3_2: P3.2(SWDIO) ; port SWDIO
NetP3_4: P3.4(SWCLK) ; port SWCLK
NetP3_10: P3.10(RST) ; port RESET
NetP4_3: P4.3 ; port DEBUG_TX
NetP4_4: P4.4 ; port DEBUG_RX

Not connected (* = marked no-connect by the designer): P3 6(SWO) 7(NC) 8(NC)

### Layout directives
differential pair: CAN0_N, CAN0_P, CAN1_N, CAN1_P

### Notes on the sheet
- SWD Programming Connector
- CAN Transceivers
- U3/U4 Notes:
  - Termination resistor should NOT be installed for normal operation. This is taken care of at the top and bottom boards of the stack.
  - Power dissipation at termination could be as high as 208mW
- (near P2) J1-J4 Notes:
  - J1 and J2 are top connectors they are available in 4 stack heights to allow for greater top side component clearance. 10144517-041802LF, 10144517-042802LF, 10144517-043802LF, and 10144517-044802LF allow for 152mil, 310mil, 467mil, and 625mil (respectively) component height clearance on top side
  - P1 and P2 are bottom connectors. Bottom component height clearance is 152mil
  - All pins should be connected to both top and bottom connectors to ensure the signals are passed to adjacent boards in the stack.
  - +VBAT and +VBAT_Preboot are up to 34VDC. Ensure adequate electrical clearance when routing
- Let's Build Rocket's Inc. Modular Paylaod System Based on TMP-010 Rev
  For more information visit https://github.com/LetsBuildRockets/Modular-Payload-System
  This work is licensed under CC BY-NC 4.0. To view a copy of this license, visit https://creativecommons.org/licenses/by-nc/4.0
- Title
- Size:
- Date:
- Assembly Variant:
- B
- Number:
- Time:
- Revision:
- Sheet
- of
- Author:
- File:
- (in symbol M2115-3005-SS) STANDOFF

### Library data of the parts
C3 C12 C13 C33 C34 = GCM155R71C104KA55D: as C26 on sheet RAM; Datasheets: http://www.murata.com/~/media/webrenewal/support/library/catalog/products/capacitor/mlcc/c03e.ashx; Image: //media.digikey.com/Renders/Murata%20Renders/ZRB-SERIES-0402.jpg; Digi-Key Part Number: 490-4759-1-ND; Part Number: GCM155R71C104KA55D; Quantity Available: 734194; @ qty: 0; Packaging: Cut Tape (CT); Series: GCM; Part Status: Active; Value: 0.10µF; Temperature Coefficient: X7R; Operating Temperature: -55°C ~ 125°C; Features: -; Ratings: AEC-Q200; Applications: Automotive; Mounting Type: Surface Mount, MLCC; Package / Case: 0402 (1005 Metric); Size / Dimension: 0.039" L x 0.020" W (1.00mm x 0.50mm); Height - Seated (Max): -; Thickness (Max): 0.022" (0.55mm); Lead Spacing: -; Lead Style: -
J1 J2 = 10144517-064802LF: Unit Price (USD): 1.95
MECH1-MECH4 = M2115-3005-SS: Unit Price (USD): 1.81
P1 P2 = 10144518-064802LF: Unit Price (USD): 1.52
P3 = 2x5_0.05_SWD: Unit Price (USD): 0.75
P4 = S4B-ZR(LF)(SN): Unit Price (USD): 0.24
R1 R6 = ERJ-P6WJ121V: RES SMD 120 OHM 5% 1/2W 0805; Manufacturer: Panasonic Electronic Components; Factory Stock: 0; Unit Price (USD): 0.08237; @ qty: 1500; Minimum Quantity: 1; Temperature Coefficient: ±200ppm/°C; Part Number: ERJ-P6WJ121V; Datasheets: https://industrial.panasonic.com/cdbs/www-data/pdf/RDA0000/AOA0000C243.pdf; Image: //media.digikey.com/Renders/Panasonic%20Renders/ERJ-0805%20Pkg.jpg; Digi-Key Part Number: P16943CT-ND; Quantity Available: 4133; Packaging: Cut Tape (CT); Series: ERJ; Part Status: Active; Value: 120; Tolerance: ±5%; Composition: Thick Film; Features: Automotive AEC-Q200, Pulse Withstanding; Operating Temperature: -55°C ~ 155°C; Package / Case: 0805 (2012 Metric); Supplier Device Package: 0805; Size / Dimension: 0.079" L x 0.049" W (2.00mm x 1.25mm); Height - Seated (Max): 0.030" (0.75mm); Number of Terminations: 2; Failure Rate: -
U3 U4 = ATA6561-GAQW: Unit Price (USD): 0.53

## Sheet Power.SchDoc
size B; SheetNumber: 2; SheetTotal: 5
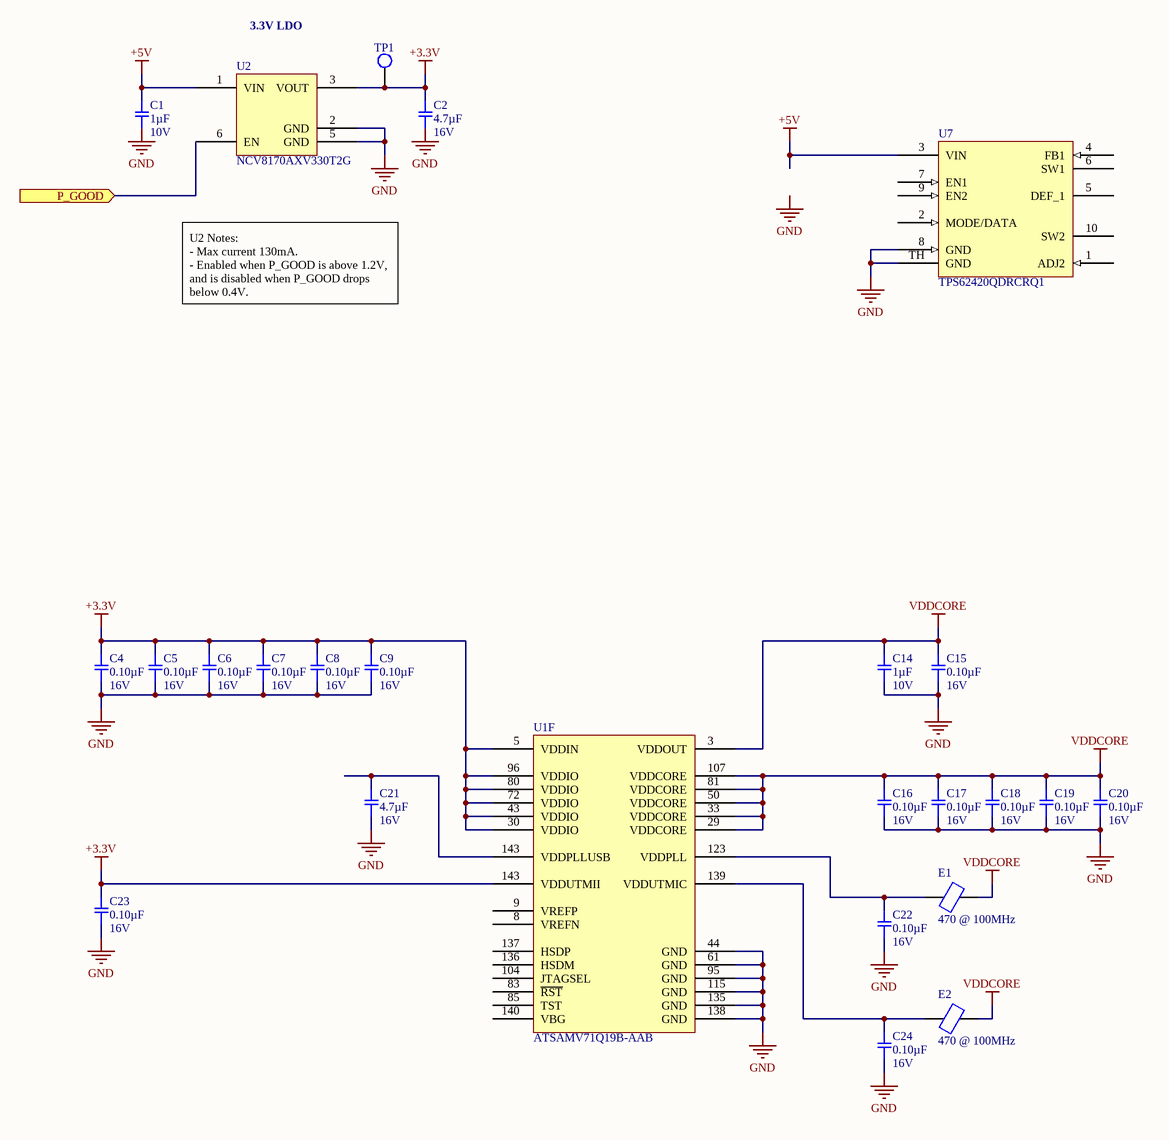
[diagram p5: Power.SchDoc]

### Parts
C1  1µF  Voltage: 10V  [SMD-0402C]
C2  4.7µF  Voltage: 16V  [SMD-0805C]
C4  0.10µF  Voltage: 16V  [SMD-0402C]
C5  0.10µF  Voltage: 16V  [SMD-0402C]
C6  0.10µF  Voltage: 16V  [SMD-0402C]
C7  0.10µF  Voltage: 16V  [SMD-0402C]
C8  0.10µF  Voltage: 16V  [SMD-0402C]
C9  0.10µF  Voltage: 16V  [SMD-0402C]
C14  1µF  Voltage: 10V  [SMD-0402C]
C15  0.10µF  Voltage: 16V  [SMD-0402C]
C16  0.10µF  Voltage: 16V  [SMD-0402C]
C17  0.10µF  Voltage: 16V  [SMD-0402C]
C18  0.10µF  Voltage: 16V  [SMD-0402C]
C19  0.10µF  Voltage: 16V  [SMD-0402C]
C20  0.10µF  Voltage: 16V  [SMD-0402C]
C21  4.7µF  Voltage: 16V  [SMD-0805C]
C22  0.10µF  Voltage: 16V  [SMD-0402C]
C23  0.10µF  Voltage: 16V  [SMD-0402C]
C24  0.10µF  Voltage: 16V  [SMD-0402C]
E1  value 470 @ 100MHz  (hidden comment: MPZ1608S471ATD25)
E2  value 470 @ 100MHz  (hidden comment: MPZ1608S471ATD25)
TP1  TP  [TP_SMD_40]  (value not drawn)  (no BOM)
U1  ATSAMV71Q19B-AAB  [TSQFP50P2200X2200X160-144N]  (part F of 6)
U2  NCV8170AXV330T2G  [SOTFL50P160X60-6N]
U7  TPS62420QDRCRQ1

### Ports
P_GOOD (in)

### Nets
+3.3V: C2.2 C4.2 C5.2 C6.2 C7.2 C8.2 C9.2 C23.2 TP1.1 U1.5(VDDIN) U1.30(VDDIO) U1.43(VDDIO) U1.72(VDDIO) U1.80(VDDIO) U1.96(VDDIO) U1.143(VDDUTMII) U2.3(VOUT)
+5V: C1.2 U2.1(VIN) U7.3(VIN)
GND: C1.1 C2.1 C4.1 C5.1 C6.1 C7.1 C8.1 C9.1 C14.1 C15.1 C16.1 C17.1 C18.1 C19.1 C20.1 C21.1 C22.1 C23.1 C24.1 U1.44(GND) U1.61(GND) U1.95(GND) U1.115(GND) U1.135(GND) U1.138(GND) U2.2(GND) U2.5(GND) U7.8(GND) U7.TH(GND)
VDDCORE: C14.2 C15.2 C16.2 C17.2 C18.2 C19.2 C20.2 E1.2 E2.2 U1.3(VDDOUT) U1.29(VDDCORE) U1.33(VDDCORE) U1.50(VDDCORE) U1.81(VDDCORE) U1.107(VDDCORE)
P_GOOD: U2.6(EN) ; port P_GOOD
NetC21_2: C21.2 U1.143(VDDPLLUSB)
NetC22_2: C22.2 E1.1 U1.123(VDDPLL)
NetC24_2: C24.2 E2.1 U1.139(VDDUTMIC)

Not connected (* = marked no-connect by the designer): U1 8(VREFN) 9(VREFP) 83(~{RST}) 85(TST) 104(JTAGSEL) 136(HSDM) 137(HSDP) 140(VBG); U7 1(ADJ2) 2(MODE/DATA) 4(FB1) 5(DEF_1) 6(SW1) 7(EN1) 9(EN2) 10(SW2)

### Notes on the sheet
- 3.3V LDO
- U2 Notes:
  - Max current 130mA.
  - Enabled when P_GOOD is above 1.2V, and is disabled when P_GOOD drops below 0.4V.
- Labels drawn without touching a wire or pin: GND
- Let's Build Rocket's Inc. Modular Paylaod System Based on TMP-010 Rev
  For more information visit https://github.com/LetsBuildRockets/Modular-Payload-System
  This work is licensed under CC BY-NC 4.0. To view a copy of this license, visit https://creativecommons.org/licenses/by-nc/4.0
- Title
- Size:
- Date:
- Assembly Variant:
- B
- Number:
- Time:
- Revision:
- Sheet
- of
- Author:
- File:

### Library data of the parts
C1 C14 = GCM155C71A105KE38D: CAP CER 1UF 10V X7S 0402; Manufacturer: Murata Electronics North America; Factory Stock: 0; Unit Price (USD): 0.12; Minimum Quantity: 1; Tolerance: ±10%; Datasheets: http://www.murata.com/~/media/webrenewal/support/library/catalog/products/capacitor/mlcc/c03e.ashx; Image: //media.digikey.com/Renders/Murata%20Renders/ZRB-SERIES-0402.jpg; Digi-Key Part Number: 490-13409-1-ND; Part Number: GCM155C71A105KE38D; Quantity Available: 7240; @ qty: 0; Packaging: Cut Tape (CT); Series: GCM; Part Status: Active; Value: 1µF; Temperature Coefficient: X7S; Operating Temperature: -55°C ~ 125°C; Features: -; Ratings: AEC-Q200; Applications: Automotive; Mounting Type: Surface Mount, MLCC; Package / Case: 0402 (1005 Metric); Size / Dimension: 0.039" L x 0.020" W (1.00mm x 0.50mm); Height - Seated (Max): -; Thickness (Max): 0.022" (0.55mm); Lead Spacing: -; Lead Style: -
C2 C21 = GCJ21BR71C475KA01L: CAP CER 4.7UF 16V X7R 0805; Manufacturer: Murata Electronics North America; Factory Stock: 0; Unit Price (USD): 0.44; Minimum Quantity: 1; Tolerance: ±10%; Datasheets: http://www.murata.com/~/media/webrenewal/support/library/catalog/products/capacitor/mlcc/c03e.ashx; Image: //media.digikey.com/Renders/Murata%20Renders/0805%20(2012%20Metric)%20.85mm.jpg; Digi-Key Part Number: 490-10557-1-ND; Part Number: GCJ21BR71C475KA01L; Quantity Available: 53217; @ qty: 0; Packaging: Cut Tape (CT); Series: GCJ; Part Status: Active; Value: 4.7µF; Temperature Coefficient: X7R; Operating Temperature: -55°C ~ 125°C; Features: Soft Termination; Ratings: AEC-Q200; Applications: Automotive, Boardflex Sensitive; Mounting Type: Surface Mount, MLCC; Package / Case: 0805 (2012 Metric); Size / Dimension: 0.079" L x 0.049" W (2.00mm x 1.25mm); Height - Seated (Max): -; Thickness (Max): 0.057" (1.45mm); Lead Spacing: -; Lead Style: -
C4-C9 C15-C20 C22-C24 = GCM155R71C104KA55D: as C26 on sheet RAM; Datasheets: http://www.murata.com/~/media/webrenewal/support/library/catalog/products/capacitor/mlcc/c03e.ashx; Image: //media.digikey.com/Renders/Murata%20Renders/ZRB-SERIES-0402.jpg; Digi-Key Part Number: 490-4759-1-ND; Part Number: GCM155R71C104KA55D; Quantity Available: 734194; @ qty: 0; Packaging: Cut Tape (CT); Series: GCM; Part Status: Active; Value: 0.10µF; Temperature Coefficient: X7R; Operating Temperature: -55°C ~ 125°C; Features: -; Ratings: AEC-Q200; Applications: Automotive; Mounting Type: Surface Mount, MLCC; Package / Case: 0402 (1005 Metric); Size / Dimension: 0.039" L x 0.020" W (1.00mm x 0.50mm); Height - Seated (Max): -; Thickness (Max): 0.022" (0.55mm); Lead Spacing: -; Lead Style: -
E1 E2 = MPZ1608S471ATD25: DCR: 150mohm; Imax: 1A; Unit Price (USD): 0.10
U1 = ATSAMV71Q19B-AAB: Unit Price (USD): 10.74
U2 = NCV8170AXV330T2G: Unit Price (USD): 0.44

## Nets that join several sheets
+3.3V: RAM (15 pins), SAMV71 (11 pins), CPU_EX (J4.23 J4.25), Connectors (6 pins), Power (17 pins)
+5V: Connectors (20 pins), Power (C1.2 U2.1 U7.3)
GND: RAM (15 pins), SAMV71 (7 pins), CPU_EX (J4.28 J4.30), Connectors (89 pins), Power (29 pins)
CAN0_RX: SAMV71 (U1.31), Connectors (U3.4)
CAN0_STBY: SAMV71 (U1.99), Connectors (U3.8)
CAN0_TX: SAMV71 (U1.26), Connectors (U3.1)
CAN1_RX: SAMV71 (U1.17), Connectors (U4.4)
CAN1_STBY: SAMV71 (U1.93), Connectors (U4.8)
CAN1_TX: SAMV71 (U1.97), Connectors (U4.1)
CTRL_SYNC: SAMV71 (R16.2), Connectors (J1.26 P1.26)
DETECT_A: SAMV71 (U1.68), Connectors (J1.32)
ETH_INT: SAMV71 (U1.23), CPU_EX (J4.24)
ETH_MDC: SAMV71 (U1.113), CPU_EX (J4.18)
ETH_MDIO: SAMV71 (U1.110), CPU_EX (J4.20)
ETH_~{RESET}: SAMV71 (U1.90), CPU_EX (J4.22)
ETH_RX0: SAMV71 (U1.125), CPU_EX (J4.12)
ETH_RX1: SAMV71 (U1.121), CPU_EX (J4.14)
ETH_RXDV: SAMV71 (U1.126), CPU_EX (J4.10)
ETH_RXER: SAMV71 (U1.119), CPU_EX (J4.16)
ETH_SIGDET: SAMV71 (U1.129), CPU_EX (J4.26)
ETH_TX0: SAMV71 (U1.131), CPU_EX (J4.6)
ETH_TX1: SAMV71 (U1.128), CPU_EX (J4.8)
ETH_TXCK: SAMV71 (U1.1), CPU_EX (J4.2)
ETH_TXEN: SAMV71 (U1.132), CPU_EX (J4.4)
MCCDA: SAMV71 (U1.112), CPU_EX (J4.3)
MCCK: SAMV71 (U1.59), CPU_EX (J4.1)
MCDA0: SAMV71 (U1.116), CPU_EX (J4.5)
MCDA1: SAMV71 (U1.118), CPU_EX (J4.7)
MCDA2: SAMV71 (U1.62), CPU_EX (J4.9)
MCDA3: SAMV71 (U1.70), CPU_EX (J4.11)
NetP1_32: SAMV71 (U1.42), Connectors (P1.32)
NetP3_4: SAMV71 (R3.1), Connectors (P3.4)
NetP3_10: SAMV71 (R2.1), Connectors (P3.10)
NetP4_3: SAMV71 (U1.66), Connectors (P4.3)
NetP4_4: SAMV71 (U1.75), Connectors (P4.4)
P_GOOD: Connectors (J1.30 P1.30), Power (U2.6)
PPS: SAMV71 (R17.2), Connectors (J1.22 P1.22)
RAM_A0: RAM (U5.23), SAMV71 (U1.120)
RAM_A1: RAM (U5.24), SAMV71 (U1.122)
RAM_A2: RAM (U5.25), SAMV71 (U1.124)
RAM_A3: RAM (U5.26), SAMV71 (U1.127)
RAM_A4: RAM (U5.29), SAMV71 (U1.130)
RAM_A5: RAM (U5.30), SAMV71 (U1.133)
RAM_A6: RAM (U5.31), SAMV71 (U1.13)
RAM_A7: RAM (U5.32), SAMV71 (U1.12)
RAM_A8: RAM (U5.33), SAMV71 (U1.76)
RAM_A9: RAM (U5.34), SAMV71 (U1.16)
RAM_A11: RAM (U5.35), SAMV71 (U1.14)
RAM_BA0: RAM (U5.20), SAMV71 (U1.22 U1.102)
RAM_CAS: RAM (U5.17), SAMV71 (U1.74)
RAM_D0: RAM (U5.2), SAMV71 (U1.11)
RAM_D1: RAM (U5.4), SAMV71 (U1.38)
RAM_D2: RAM (U5.5), SAMV71 (U1.39)
RAM_D3: RAM (U5.7), SAMV71 (U1.40)
RAM_D4: RAM (U5.8), SAMV71 (U1.41)
RAM_D5: RAM (U5.10), SAMV71 (U1.58)
RAM_D6: RAM (U5.11), SAMV71 (U1.54)
RAM_D7: RAM (U5.13), SAMV71 (U1.48)
RAM_D8: RAM (U5.42), SAMV71 (U1.4)
RAM_D9: RAM (U5.44), SAMV71 (U1.6)
RAM_D10: RAM (U5.45), SAMV71 (U1.7)
RAM_D11: RAM (U5.47), SAMV71 (U1.10)
RAM_D12: RAM (U5.48), SAMV71 (U1.27)
RAM_D13: RAM (U5.50), SAMV71 (U1.28)
RAM_D14: RAM (U5.51), SAMV71 (U1.49)
RAM_D15: RAM (U5.53), SAMV71 (U1.45)
RAM_NBS0: RAM (U5.39), SAMV71 (U1.111)
RAM_NBS1: RAM (U5.15), SAMV71 (U1.106)
RAM_RAS: RAM (U5.18), SAMV71 (U1.78)
RAM_SDA10: RAM (U5.22), SAMV71 (U1.88)
RAM_SDCK: RAM (U5.38), SAMV71 (U1.57)
RAM_SDCKE: RAM (U5.37), SAMV71 (U1.84)
RAM_SDWE: RAM (U5.16), SAMV71 (U1.108)
SCL0: SAMV71 (R15.1 U1.77 U6.7), CPU_EX (J4.15)
SDA0: SAMV71 (R14.1 U1.91 U6.8), CPU_EX (J4.13)

## Assembly variants
CPU-011: not fitted P1 P2 R33